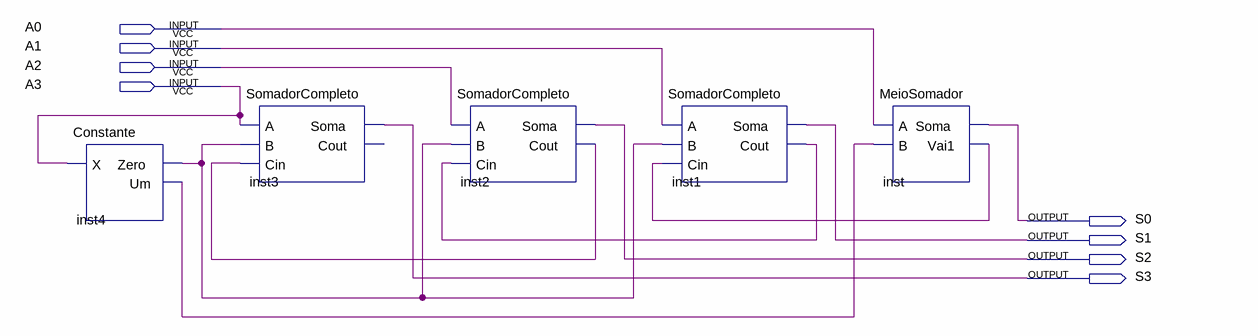
[diagram p0: schematic sheet]
// Quartus schematic Somador4B.bdf as structural Verilog: 5 symbols, 8 pins
module Somador4B (
  input  A0,
  input  A1,
  input  A2,
  input  A3,
  output S0,
  output S1,
  output S2,
  output S3
);

  wire inst1_cout, inst2_cout, inst4_um, inst4_zero, inst_vai1;

  Constante inst4 (.X(A3), .Zero(inst4_zero), .Um(inst4_um));
  SomadorCompleto inst3 (.A(A3), .B(inst4_zero), .Cin(inst2_cout), .Soma(S3));  // open: Cout
  SomadorCompleto inst2 (.A(A2), .B(inst4_zero), .Cin(inst1_cout), .Soma(S2), .Cout(inst2_cout));
  SomadorCompleto inst1 (.A(A1), .B(inst4_zero), .Cin(inst_vai1), .Soma(S1), .Cout(inst1_cout));
  MeioSomador inst (.A(A0), .B(inst4_um), .Soma(S0), .Vai1(inst_vai1));
endmodule
